# EAGLE design atmega32u4bb (EAGLE 6.4)
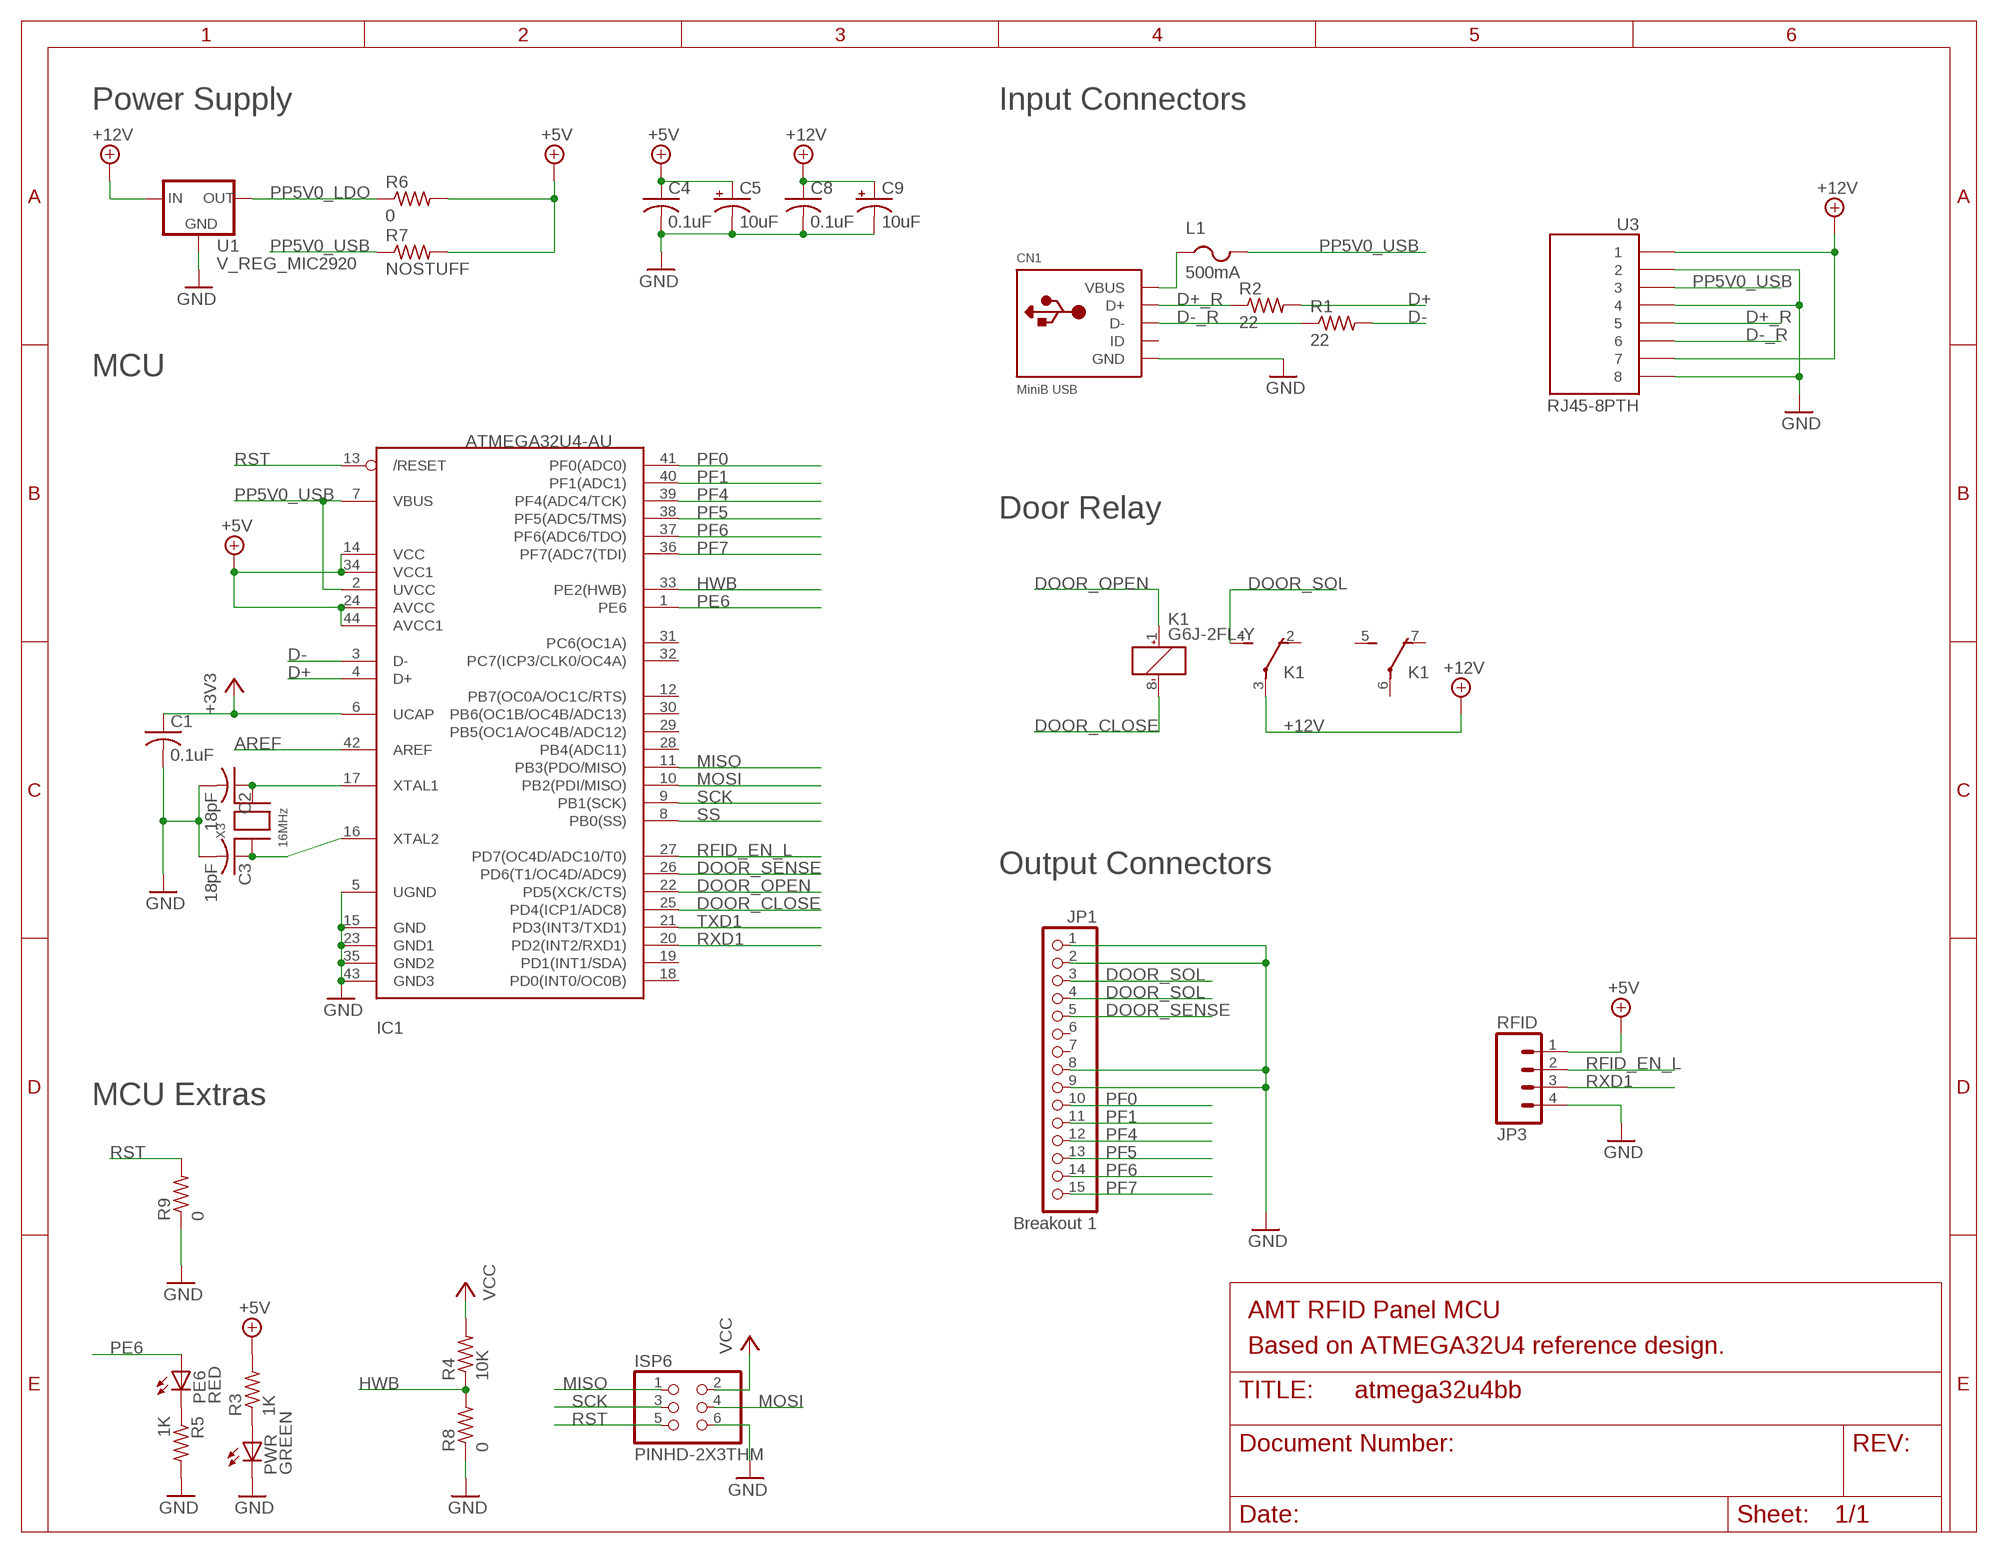
[diagram p0: schematic, sheet 1]

## Parts
C1  0.1uF  C-USC0805K  [C0805K]
C2  18pF  C-USC0805K  [C0805K]
C3  18pF  C-USC0805K  [C0805K]
C4  0.1uF  C-USC0805K  [C0805K]
C5  10uF  CPOL-USA/3216-18R  [A/3216-18R]
C8  0.1uF  C-USC0805K  [C0805K]
C9  10uF  CPOL-USA/3216-18R  [A/3216-18R]
CN1  MiniB USB  USBMINIB  [USB-MINIB]
IC1  ATMEGA32U4-AU  [TQFP44]
ISP6  PINHD-2X3THM  [ISP6]
JP1  Breakout 1  PINHD-1X15-CB  [1X15-CB]
JP3  RFID  M04LOCK  [1X04_LOCK]
K1  G6J-2FL-Y  [G6J-2FL-Y]
L1  500mA  PTCFUSE-1206  [R1206]
PE6  RED  LEDCHIPLED_0805  [CHIPLED_0805]
PWR  GREEN  LEDCHIPLED_0805  [CHIPLED_0805]
R1  22  R-US_R0805  [R0805]
R2  22  R-US_R0805  [R0805]
R3  1K  R-US_R0805  [R0805]
R4  10K  R-US_R0805  [R0805]
R5  1K  R-US_R0805  [R0805]
R6  0  R-US_R0805  [R0805]
R7  NOSTUFF  R-US_R0805  [R0805]
R8  0  R-US_R0805  [R0805]
R9  0  R-US_R0805  [R0805]
U1  V_REG_MIC2920  [SOT223]
U3  RJ45-8PTH  [RJ45-8]
X3  16MHz  XTALNX5032  [NX5032]

## Nets
+3V3: C1.1 IC1.6(UCAP)
+5V: C4.1 C5.+ IC1.14(VCC) IC1.24(AVCC) IC1.34(VCC1) IC1.44(AVCC1) JP3.1 R3.2 R6.2 R7.2
+12V: C8.1 C9.+ K1.3(2:P) U1.1(IN) U3.1 U3.7
AREF: IC1.42(AREF)
D+: IC1.4(D+) R2.2
D+_R: CN1.D+ R2.1 U3.5
D-: IC1.3(D-) R1.2
D-_R: CN1.D- R1.1 U3.6
DOOR_CLOSE: IC1.25(PD4(ICP1/ADC8)) K1.8(1:-)
DOOR_OPEN: IC1.22(PD5(XCK/CTS)) K1.1(1:+)
DOOR_SENSE: IC1.26(PD6(T1/OC4D/ADC9)) JP1.5
DOOR_SOL: JP1.3 JP1.4 K1.4(2:S)
GND: C1.2 C2.2 C3.2 C4.2 C5.- C8.2 C9.- CN1.GND IC1.5(UGND) IC1.15(GND) IC1.23(GND1) IC1.35(GND2) IC1.43(GND3) ISP6.6 JP1.1 JP1.2 JP1.8 JP1.9 JP3.4 PWR.C R5.2 R8.1 R9.1 U1.2(GND) U1.4(GND) U3.2 U3.4 U3.8
HWB: IC1.33(PE2(HWB)) R4.1 R8.2
MISO: IC1.11(PB3(PDO/MISO)) ISP6.1
MOSI: IC1.10(PB2(PDI/MISO)) ISP6.4
N$1: PWR.A R3.1
N$8: C2.1 IC1.17(XTAL1) X3.P$2
N$9: C3.1 IC1.16(XTAL2) X3.P$1
N$10: PE6.C R5.1
PE6: IC1.1(PE6) PE6.A
PF0: IC1.41(PF0(ADC0)) JP1.10
PF1: IC1.40(PF1(ADC1)) JP1.11
PF4: IC1.39(PF4(ADC4/TCK)) JP1.12
PF5: IC1.38(PF5(ADC5/TMS)) JP1.13
PF6: IC1.37(PF6(ADC6/TDO)) JP1.14
PF7: IC1.36(PF7(ADC7(TDI)) JP1.15
PP5V0_LDO: R6.1 U1.3(OUT)
PP5V0_USB: IC1.2(UVCC) IC1.7(VBUS) L1.2 R7.1 U3.3
RFID_EN_L: IC1.27(PD7(OC4D/ADC10/T0)) JP3.2
RST: IC1.13(/RESET) ISP6.5 R9.2
RXD1: IC1.20(PD2(INT2/RXD1)) JP3.3
SCK: IC1.9(PB1(SCK)) ISP6.3
SS: IC1.8(PB0(SS))
TXD1: IC1.21(PD3(INT3/TXD1))
VBUS: CN1.VBUS L1.1
VCC: ISP6.2 R4.2
Unconnected: CN1.ID IC1.12(PB7(OC0A/OC1C/RTS)) IC1.18(PD0(INT0/OC0B)) IC1.19(PD1(INT1/SDA)) IC1.28(PB4(ADC11)) IC1.29(PB5(OC1A/OC4B/ADC12)) IC1.30(PB6(OC1B/OC4B/ADC13)) IC1.31(PC6(OC1A)) IC1.32(PC7(ICP3/CLK0/OC4A)) JP1.6 JP1.7 K1.2(2:O) K1.5(3:S) K1.6(3:P) K1.7(3:O)

## Notes on the sheet
- Power Supply | Input Connectors
- MCU
- Door Relay
- Output Connectors
- MCU Extras
- AMT RFID Panel MCU
- Based on ATMEGA32U4 reference design.

## Library data of the parts
C1-C4 C8 = adafruit:C-US: CAPACITOR, American symbol
C5 C9 = adafruit:CPOL-US: POLARIZED CAPACITOR, American symbol
CN1 = adafruit:USB: USB Connectors USBMINIB - Surface Mount Female Mini-B USB Connector 4UConnector: 06564 By microbuilder.eu Thru-hole RA Female Mini-B USB Connector 4UConnector: 18732 By ladyada.net
IC1 = adaprog:ATMEGA32U4
ISP6 = adaprog:PINHD-2X3
JP1 = adafruit:PINHD-1X15: PIN HEADER
JP3 = SparkFun-Connectors:M04: Header 4 Standard 4-pin 0.1" header. Use with straight break away headers (SKU : PRT-00116), right angle break away headers (PRT-00553), swiss pins (PRT-00743), machine pins (PRT-00117), and female headers (PRT-00115). Molex polarized connector foot print use with SKU : PRT-08231 with associated crimp pins and housings. 1MM SMD Version SKU: PRT-10208
K1 = relay:G6J*-2?-Y: Surface-Mounting Signal Relay - G6J-Y 5.7 x 10.6 x 9 mm Source: http://www.omroncomponents.eu/ .. K125-E2-02-X.pdf; MPN: G6J-2FL-Y-TR DC4.5; OC_FARNELL: 1798618; OC_NEWARK: 04M9907
L1 = adafruit:PTCFUSE: PTC fuses, resettable thermistors
PE6 PWR = adafruit:LED: LED OSRAM: - CHIPLED LG R971, LG N971, LY N971, LG Q971, LY Q971, LO R971, LY R971 LH N974, LH R974 LS Q976, LO Q976, LY Q976 LO Q996 - Hyper CHIPLED LW Q18S LB Q993, LB Q99A, LB R99A - SideLED LS A670, LO A670, LY A670, LG A670, LP A670 LB A673, LV A673, LT A673, LW A673 LH A674 LY A675 LS A676, LA A676, LO A676, LY A676, LW A676 LS A679, LY A679, LG A679 - Hyper Micro SIDELED® LS Y876, LA Y876, LO Y876, LY Y876 LT Y87S - SmartLED LW L88C, LW L88S LB L89C, LB L89S, LG L890 LS L89K, LO L89K, LY L89K LS L896, LA L896, LO L896, LY L896 - TOPLED LS T670, LO T670, LY T670, LG T670, LP T670 LSG T670, LSP T670, LSY T670, LOP T670, LYG T670 LG T671, LOG T671, LSG T671 LB T673, LV T673, LT T673, LW T673 LH T674 LS T676, LA T676, LO T676, LY T676, LB T676, LH T676, LSB T676, LW T676 LB T67C, LV T67C, LT T67C, LS T67K, LO T67K, LY T67K, LW E67C LS E67B, LA E67B, LO E67B, LY E67B, LB E67C, LV E67C, LT E67C LW T67C LS T679, LY T679, LG T679 LS T770, LO T770, LY T770, LG T770, LP T770 LB T773, LV T773, LT T773, LW T773 LH T774 LS E675, LA E675, LY E675, LS T675 LS T776, LA T776, LO T776, LY T776, LB T776 LHGB T686 LT T68C, LB T68C - Hyper Mini TOPLED® LB M676 - Mini TOPLED Santana® LG M470 LS M47K, LO M47K, LY M47K Source: http://www.osram.convergy.de/
R1-R9 = adafruit:R-US_: RESISTOR, American symbol
U1 = amtdoor2:V_REG_MIC2920: MIC2920A (http://www.micrel.com/_PDF/mic2920.pdf) - 400mA output LDO Regulator
U3 = SparkFun-Connectors:RJ45-8: RJ45 Jack Simple RJ45, 8-pin connection - connector for common Cat5, Cat5e, and Cat6 Ethernet cables. Footprint not yet proven in production. Connector sku is PRT-00643; Breakout PCB sku is BOB-00716.
X3 = adaprog:XTAL

## Board
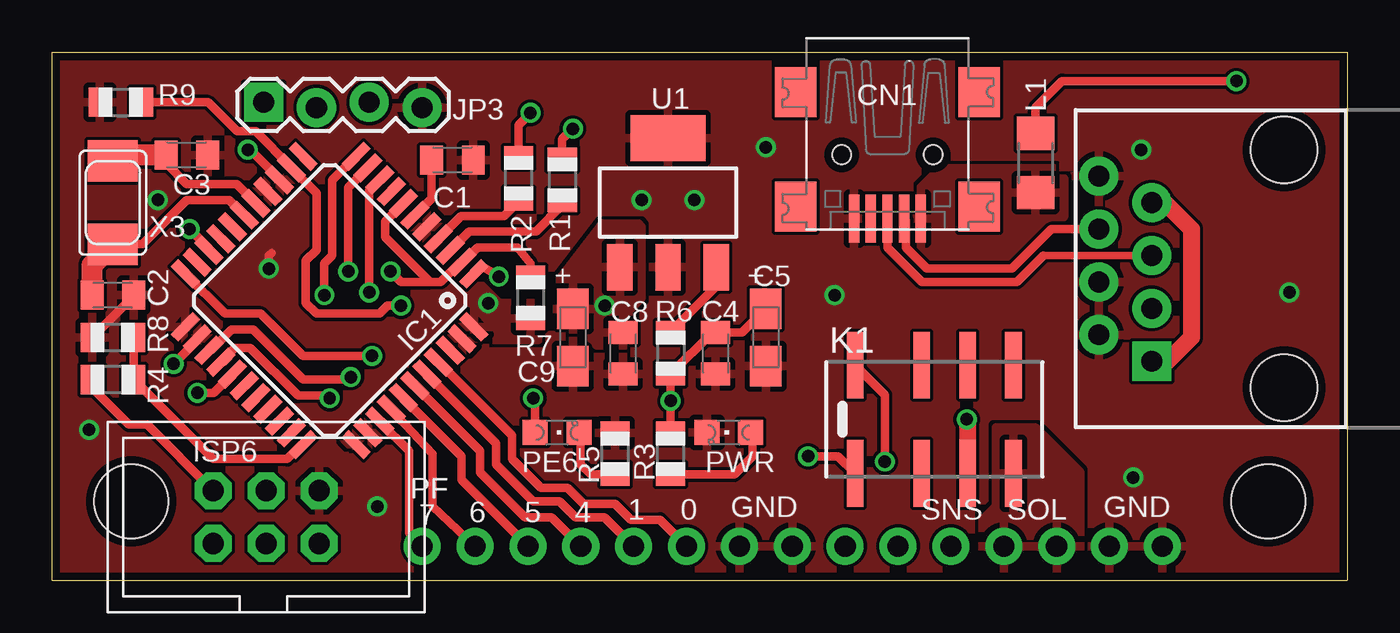
[diagram p1: board, top side]
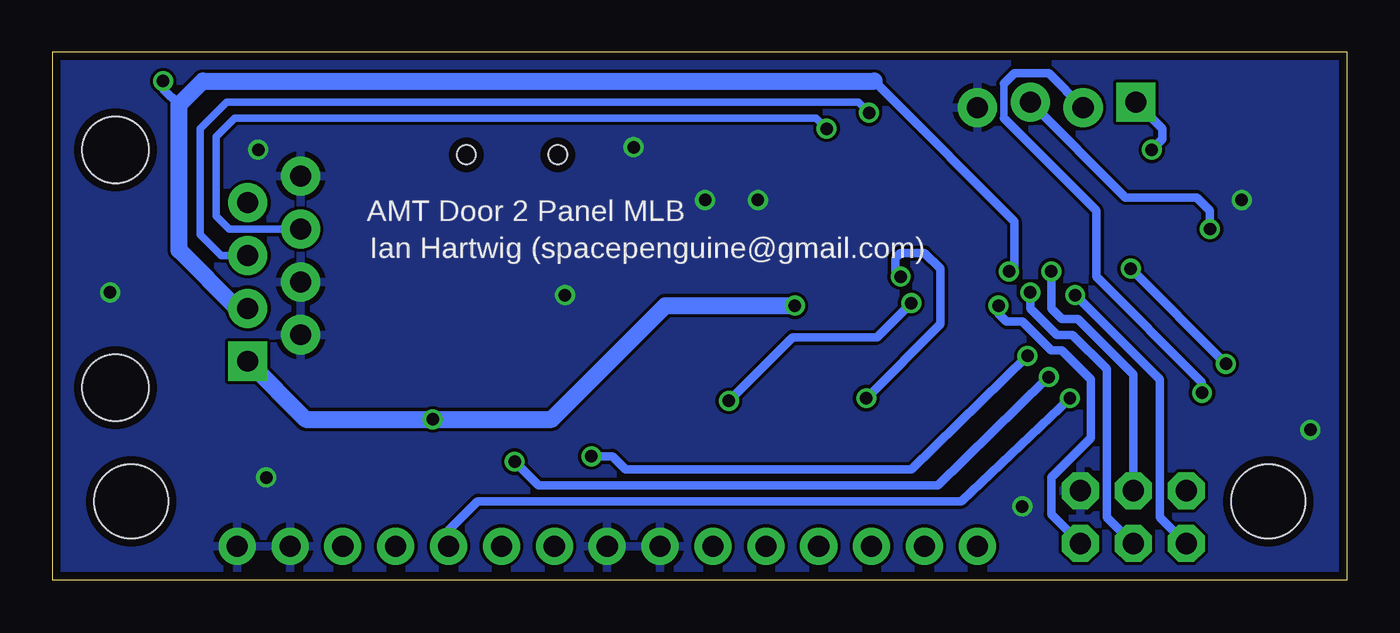
[diagram p2: board, bottom side, seen from below]

Size 62.23 x 25.4 mm. Coordinates in mm from the lower left corner, seen from the top.
Outline: 0,0 0,25.4 62.23,25.4 62.23,0 0,0
Copper layers (1*16): Top 0.0356mm / dielectric 1.5011mm / Bottom 0.0356mm
Design rules "LaenPCBOrder": minimum track width 6mil, minimum drill 13mil, track to track 6mil, track to pad 6mil, pad to pad 6mil, via to via 6mil, smd to smd 6mil, copper to edge 15mil, drill to drill 6mil, minimum pad ring 7mil, minimum via ring 7mil, stop-mask expansion 3mil, vias tented up to drill 0mil, thermal gap 10mil
Holes 3.56 mm at 3.81,3.81 58.42,3.81

### Footprints (pad centres in the part's own frame; a part is rotated, then mirrored left to right if it is on the bottom)
C0805K = smd 1.1 x 1.4: 1 -1,0; 2 1,0
A/3216-18R = smd 1.95 x 1.5: + 1.375,0; - -1.375,0
USB-MINIB = smd 0.5 x 2.308: D+ 0,4.064; D- -0.8,4.064; GND 1.6,4.064; ID 0.8,4.064; VBUS -1.6,4.064 | smd 2 x 2.4: GND1 -4.4,-2; GND2 -4.4,3.5; GND3 4.4,3.5; GND4 4.4,-2 | hole 0.9: -2.2,1; 2.2,1
TQFP44 = smd 1.5 x 0.5: 1 -5.8,4; 2 -5.8,3.2; 3 -5.8,2.4; 4 -5.8,1.6; 5 -5.8,0.8; 6 -5.8,0; 7 -5.8,-0.8; 8 -5.8,-1.6; 9 -5.8,-2.4; 10 -5.8,-3.2; 11 -5.8,-4; 23 5.8,-4; 24 5.8,-3.2; 25 5.8,-2.4; 26 5.8,-1.6; 27 5.8,-0.8; 28 5.8,0; 29 5.8,0.8; 30 5.8,1.6; 31 5.8,2.4; 32 5.8,3.2; 33 5.8,4 | smd 0.5 x 1.5: 12 -4,-5.8; 13 -3.2,-5.8; 14 -2.4,-5.8; 15 -1.6,-5.8; 16 -0.8,-5.8; 17 0,-5.8; 18 0.8,-5.8; 19 1.6,-5.8; 20 2.4,-5.8; 21 3.2,-5.8; 22 4,-5.8; 34 4,5.8; 35 3.2,5.8; 36 2.4,5.8; 37 1.6,5.8; 38 0.8,5.8; 39 0,5.8; 40 -0.8,5.8; 41 -1.6,5.8; 42 -2.4,5.8; 43 -3.2,5.8; 44 -4,5.8
ISP6 = drill 1.016 pad 1.778 octagon: 1 -2.54,-1.27; 2 -2.54,1.27; 3 0,-1.27; 4 0,1.27; 5 2.54,-1.27; 6 2.54,1.27
1X15-CB = drill 1.016 pad 1.778: 1 -17.78,0; 2 -15.24,0; 3 -12.7,0; 4 -10.16,0; 5 -7.62,0; 6 -5.08,0; 7 -2.54,0; 8 0,0; 9 2.54,0; 10 5.08,0; 11 7.62,0; 12 10.16,0; 13 12.7,0; 14 15.24,0; 15 17.78,0
1X04_LOCK = drill 1.016 pad 1.88 square: 1 0,0.127 | drill 1.016 pad 1.88: 2 2.54,-0.127; 3 5.08,0.127; 4 7.62,-0.127
G6J-2FL-Y = smd 0.8 x 3.2: 1 -3.2,-2.6; 2 0,-2.6; 3 2.2,-2.6; 4 4.4,-2.6; 5 4.4,2.6; 6 2.2,2.6; 7 0,2.6; 8 -3.2,2.6
R1206 = smd 1.6 x 1.803: 1 -1.422,0; 2 1.422,0
CHIPLED_0805 = smd 1.2 x 1.2: A 0,-1.05; C 0,1.05
R0805 = smd 1.1 x 1.4: 1 -1,0; 2 1,0
SOT223 = smd 1.219 x 2.235: 1 -2.311,-3.099; 2 0,-3.099; 3 2.311,-3.099 | smd 3.6 x 2.2: 4 0,3.099
RJ45-8 = drill 1 pad 1.88 square: 1 -4.445,6.35 | drill 1 pad 1.88: 2 -3.175,8.89; 3 -1.905,6.35; 4 -0.635,8.89; 5 0.635,6.35; 6 1.905,8.89; 7 3.175,6.35; 8 4.445,8.89 | hole 3.2: -5.715,0; 5.715,0
NX5032 = smd 2 x 2.4: P$1 2,0; P$2 -2,0

### Placement (x,y rotation side)
C1  19.24,20.21 0 top
C2  2.92,13.72 0 top
C3  6.48,20.45 0 top
C4  31.88,10.92 270 top
C5  34.29,11.68 90 top
C8  27.43,10.92 270 top
C9  25.02,11.68 90 top
CN1  40.13,21.46 180 top
IC1  13.34,13.46 225 top
ISP6  10.29,3.05 0 top
JP1  35.56,1.65 180 top
JP3  10.16,22.86 0 top
K1  41.78,7.75 0 top
L1  47.24,20.07 90 top
PE6  24.26,7.11 270 top
PWR  32.51,7.11 90 top
R1  24.51,19.25 270 top
R2  22.4,19.33 270 top
R3  29.72,6.1 90 top
R4  2.92,9.65 180 top
R5  27.05,6.1 90 top
R6  29.72,10.92 270 top
R7  22.99,13.59 270 top
R8  2.92,11.68 0 top
R9  3.3,22.99 0 top
U1  29.59,18.16 0 top
U3  59.18,14.99 90 top
X3  2.92,18.16 90 top

### Tracks (layer width: path | path; a pad name or v marks a point on that pad's centre or on a via)
+3V3
  Top 0.406: IC1.6 18.24,18.36 C1.1
+5V  (via drill 0.6)
  Top 0.406: C5.+ 33.15,11.92 C4.1 31.72,11.92 R6.2 v29.72,8.64 R3.2 | IC1.14 10.93,19.3 9.65,20.57 v9.4,20.7 | IC1.24 6.97,11.54 v5.84,10.41 | v10.41,14.99 10.41,15.62 10.54,15.75
  Bottom 0.406: v29.72,8.64 26.67,11.68 22.61,11.68 v20.95,13.34 | v9.4,20.7 8.89,21.21 8.89,21.72 JP3.1 | v5.84,10.41 v10.41,14.99
  pour Top: 12.19,20.32 6.6,14.73 6.6,14.35 7.24,13.72 7.24,13.34 6.35,12.45 12.32,6.48 12.95,7.11 13.72,7.11 14.35,6.48 14.48,6.48 19.81,12.06 20.32,12.06 20.83,11.56 23.37,11.56 23.5,12.06 23.5,13.34 21.46,13.34 14.35,20.45 14.22,20.45 13.59,19.81 12.95,19.81 12.45,20.32
+12V  (via drill 0.6)
  Top 0.813: U3.7 53.47,18.16 54.74,16.89 54.74,11.68 53.59,10.54 U3.1 | v43.94,7.75 43.98,7.71 K1.3
  Bottom 0.813: U3.1 50.04,7.75 v43.94,7.75 38.23,7.75 32.77,13.21 v26.54,13.21
  pour Top (rank 2): 24.26,12.06 25.53,12.06 26.16,11.3 27.56,11.3 27.69,11.43 27.69,12.95 28.32,13.59 28.32,17.02 28.19,17.14 26.42,17.14 24.26,14.35
D+
  Top 0.406: IC1.4 19.66,17.53 21.72,17.53 22.41,18.21 R2.2
D+_R  (via drill 0.6)
  Top 0.356: U3.5 47.62,15.62
  Top 0.406: 47.62,15.62 46.35,14.35 41.78,14.35 40.13,16 CN1.D+ | R2.1 22.41,21.9 v22.99,22.48
  Bottom 0.356: v22.99,22.48 23.5,22.99 53.85,22.99 55.12,21.72 55.12,16.64 54.1,15.62 U3.5
D-
  Top 0.406: IC1.3 20.03,16.76 23.24,16.76 24.51,18.03 R1.2
D-_R  (via drill 0.6)
  Top 0.406: U3.6 48.01,16.89 46.1,14.99 42.04,14.99 41.02,16 41.02,17.31 CN1.D- | R1.1 24.51,21.21 v25.02,21.72
  Bottom 0.356: v25.02,21.72 25.53,22.23 53.47,22.23 54.36,21.34 54.36,17.53 53.72,16.89 U3.6
DOOR_CLOSE  (via drill 0.6)
  Top 0.406: IC1.25 7.63,11.06 8.64,12.06 9.65,12.06 12.06,9.65 14.22,9.65 v14.35,9.78 | v40.01,5.71 40.01,8.93 K1.8
  Bottom 0.406: v14.35,9.78 14.48,9.65 19.68,4.57 38.86,4.57 v40.01,5.71
DOOR_OPEN  (via drill 0.6)
  Top 0.406: IC1.22 8.31,12.83 10.03,12.83 12.06,10.79 v15.37,10.79 | v36.32,5.97 37.76,5.97 K1.1
  Bottom 0.406: v36.32,5.97 35.31,5.97 34.67,5.33 20.95,5.33 v15.37,10.79
DOOR_SENSE  (via drill 0.6)
  Top 0.406: v13.34,8.76 13.21,8.89 11.81,8.89 9.53,11.18 8.76,11.18 8.51,10.92 8.51,10.79 8.21,10.49 IC1.26
  Bottom 0.406: JP1.5 43.18,2.41 41.78,3.81 18.54,3.81 v13.34,8.76
DOOR_SOL
  pour Top: 45.34,7.37 45.34,3.56 44.7,2.92 44.7,1.02 45.34,0.38 48.77,0.38 49.4,1.02 49.4,5.21 47.24,7.37 45.47,7.37
GND  (via drill 0.6)
  Top 0.406: R8.1 3.92,13.68 C2.2
  other vias: 5.08,18.29 1.78,7.24 37.59,13.72 51.94,4.95 28.32,18.29 30.86,18.29 15.62,3.56 34.29,20.83 52.32,20.7 59.44,13.84
  pour Bottom: 0,0 0,38.1 62.23,38.1 62.23,0
  pour Top (rank 6): 0,0 0,25.4 62.23,25.4 62.23,0
HWB
  Top 0.406: IC1.33 11.99,6.53 11.3,5.84 7.73,5.84 R4.1 R8.2
MISO  (via drill 0.6)
  Top 0.406: IC1.11 13.46,19.25 13.46,15.62 13.08,15.24 v13.08,13.72
  Bottom 0.406: v13.08,13.72 9.02,9.65 9.02,3.05 ISP6.1
MOSI  (via drill 0.6)
  Top 0.406: IC1.10 14.22,18.88 v14.22,14.86
  Bottom 0.406: v14.22,14.86 14.22,13.08 13.72,12.57 12.95,12.57 10.29,9.91 ISP6.4
N$1
  Top 0.406: R3.1 32.78,5.1 33.66,5.97 33.66,7.02 PWR.A
N$8
  Top 0.406: IC1.17 8.51,18.29 6.48,18.29 4.35,16.16 X3.P$2
  Top 1.016: C2.1 1.92,15.16 X3.P$2
N$9
  Top 0.406: IC1.16 8.88,19.05 6.48,19.05 5.48,20.05 C3.1
  Top 1.016: C3.1 3.21,20.45 X3.P$1
N$10
  Top 0.406: R5.1 25.89,5.1 25.4,5.59 25.4,7.02 PE6.C
PE6  (via drill 0.6)
  Top 0.406: IC1.1 20.64,15.11 v21.46,14.61 | v23.11,8.76 23.21,8.67 PE6.A
  Bottom 0.406: v21.46,14.61 21.72,14.86 21.72,15.49 21.46,15.75 20.32,15.75 19.56,14.99 19.56,12.32 v23.11,8.76
PF0
  Top 0.406: IC1.41 18.59,10.49 22.1,6.99 22.1,5.84 23.5,4.45 24.77,4.45 25.53,3.68 27.05,3.68 27.81,2.92 29.21,2.92 JP1.10
PF1
  Top 0.406: JP1.11 26.54,3.05 25.15,3.05 24.38,3.81 23.11,3.81 21.34,5.59 21.34,6.59 IC1.40
PF4
  Top 0.406: IC1.39 | IC1.39 20.57,6.22 20.57,5.21 22.73,3.05 24,3.05 JP1.12
PF5
  Top 0.406: IC1.38 16.87,8.78 19.68,5.97 19.68,4.83 JP1.13
PF6
  Top 0.406: IC1.37 16.3,8.21 18.29,6.1 18.29,3.56 JP1.14
PF7
  Top 0.406: IC1.36 15.74,7.63 17.14,6.22 17.14,2.29 JP1.15
PP5V0_LDO
  Top 0.406: R6.1 29.72,11.94 31.88,14.1 31.88,15.04 U1.3
PP5V0_USB  (via drill 0.6)
  Top 0.406: R7.1 22.99,15.24 22.35,16 20.45,16 19.75,15.3 IC1.2 19.62,15.3 18.67,14.35 18.16,14.35 | 18.16,14.35 16,16.51 16,17.26 IC1.7 | L1.2 47.24,22.73 48.51,24 v56.9,24 | v16.26,14.86 16.76,14.35 18.16,14.35
  Bottom 0.406: v56.9,24 56.9,23.62 56.13,22.86 | 22.73,24 22.23,23.48 16,17.26 16,15.11 v16.26,14.86
  Bottom 0.813: U3.3 53.34,13.08 56.13,15.88 56.13,22.86 54.99,24 22.73,24
RFID_EN_L  (via drill 0.6)
  Top 0.406: v6.99,9.02 7.76,9.02 IC1.27
  Bottom 0.356: 16.51,23.88 16.51,22.23
  Bottom 0.406: JP3.2 14.35,24.38 16,24.38 16.51,23.88 | 16.51,22.23 12.06,17.78 12.06,14.61 6.99,9.53 v6.99,9.02
RST  (via drill 0.6)
  Top 0.406: R9.2 7.49,22.99 8.89,21.59 9.78,21.59 11.5,19.87 IC1.13 12.7,18.62 12.7,15.88 12.19,15.37 12.19,13.34 12.7,12.83 15.75,12.83 16.13,13.21 v16.76,13.21
  Bottom 0.406: ISP6.5 14.22,3.17 14.22,4.95 12.32,6.86 12.32,9.65 13.72,11.05 14.22,11.05 15.62,12.45 16.38,12.45 16.76,12.83 v16.76,13.21
RXD1  (via drill 0.6)
  Top 0.406: IC1.20 7.54,15.96 v6.6,16.89
  Bottom 0.406: v6.6,16.89 6.6,17.78 7.24,18.41 10.67,18.41 JP3.3
SCK  (via drill 0.6)
  Top 0.406: IC1.9 15.24,18.76 v15.24,13.84
  Bottom 0.406: v15.24,13.84 15.24,13.08 13.97,11.81 13.21,11.81 11.56,10.16 11.56,3.05 ISP6.3
VBUS
  pour Top: 41.4,18.54 41.4,16.13 42.16,15.37 46.48,15.37 48.64,17.53 48.64,19.3 48.13,19.81 42.67,19.81
VCC
  Top 0.406: R4.2 1.92,9.26 3.68,7.49 4.57,7.49 ISP6.2

### Text on the board
tNames: PF | 7 | 6 | 5 | 4 | 1 | 0 | GND | SNS | SOL | GND
bNames: AMT Door 2 Panel MLB | Ian Hartwig (spacepenguine@gmail.com)